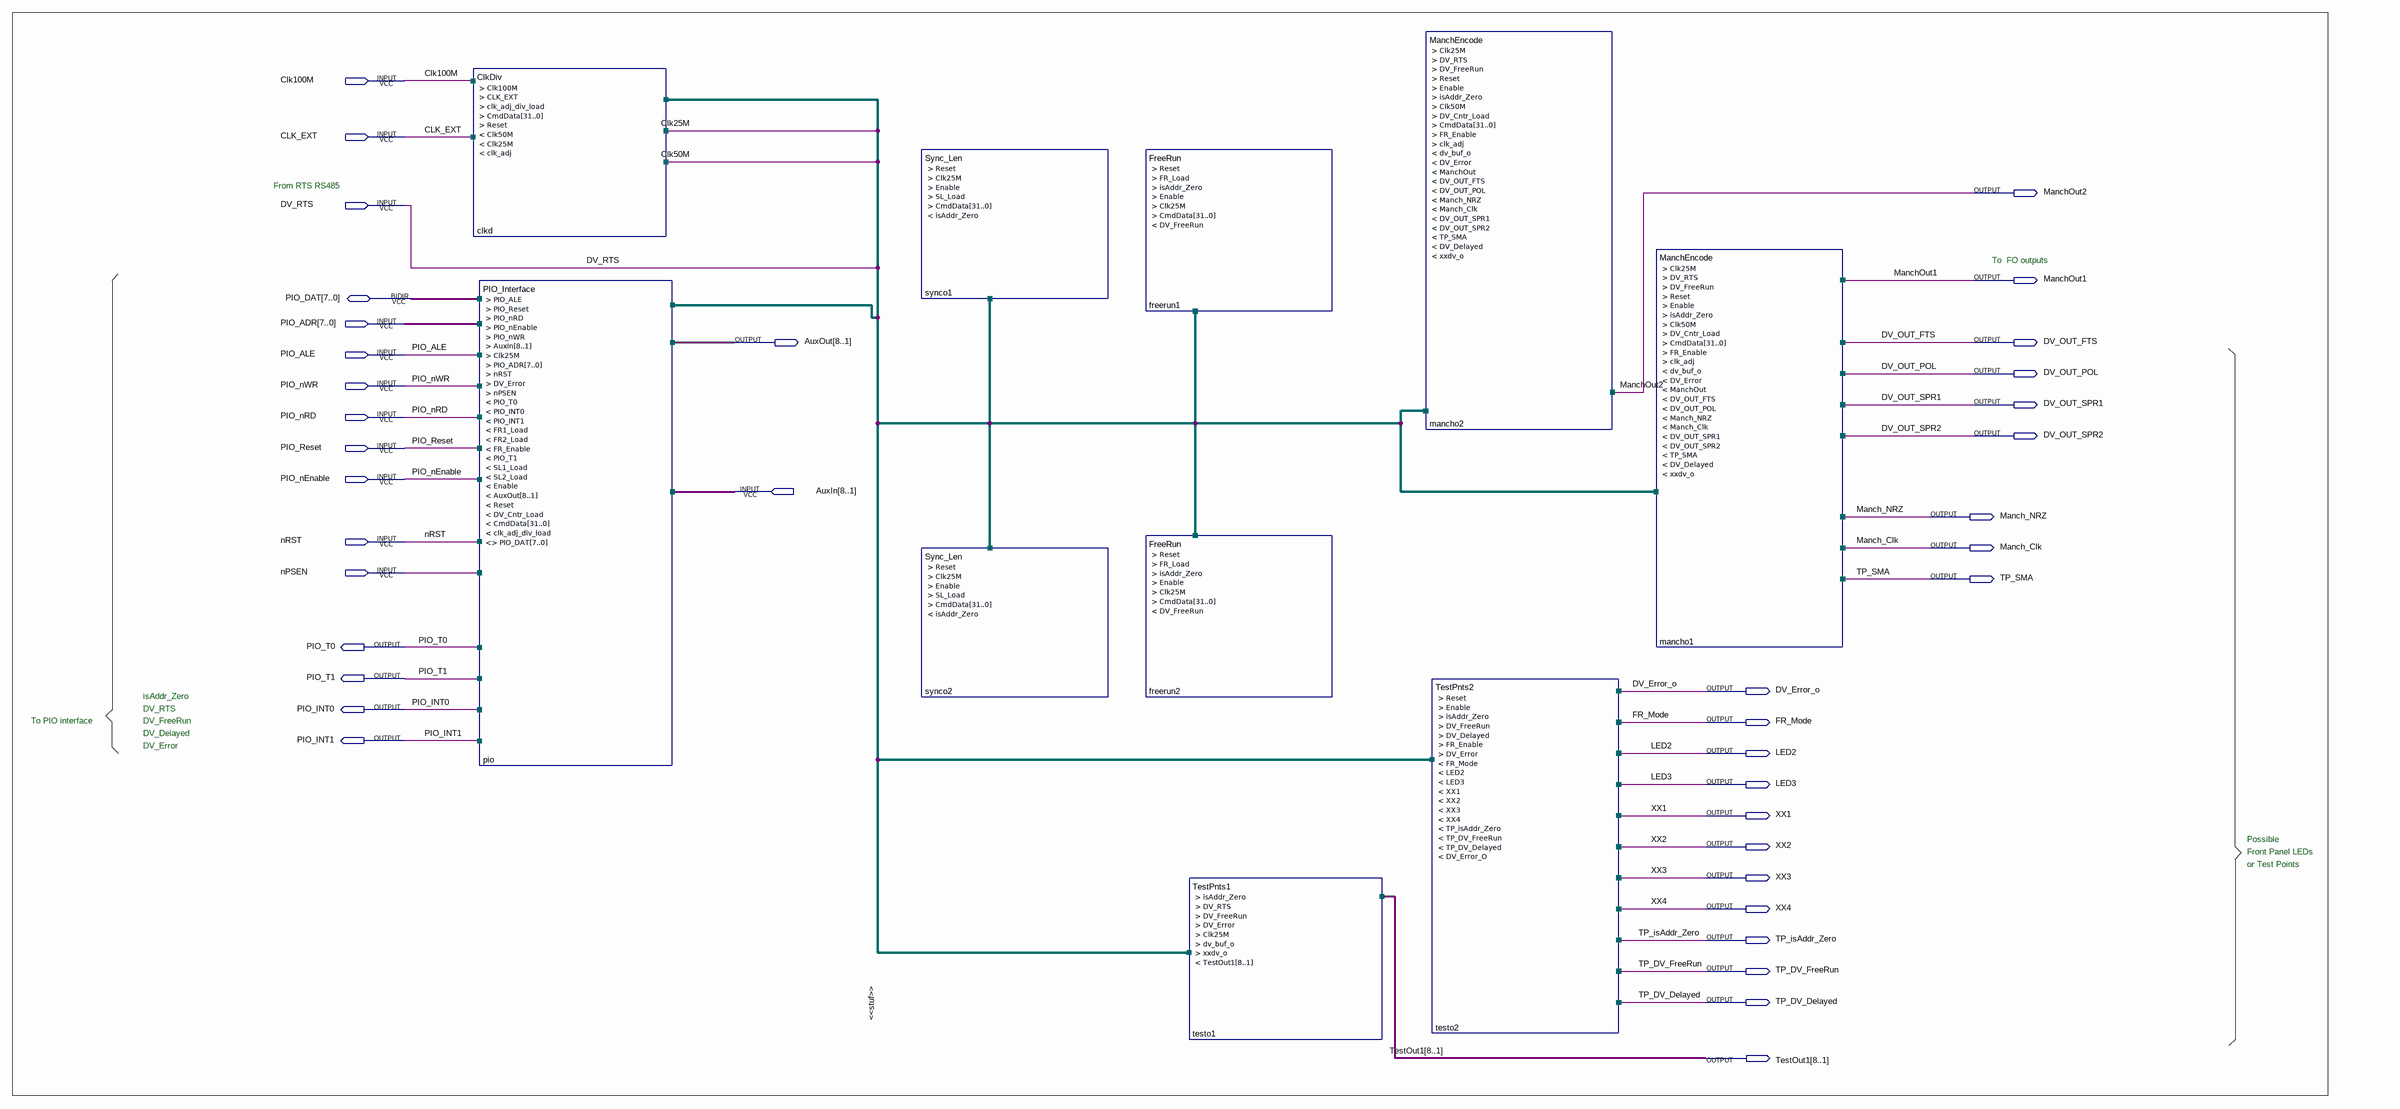
[diagram p0: schematic sheet]
// Quartus schematic SyncBox.bdf as structural Verilog: 10 symbols, 39 pins
module SyncBox (
  input  Clk100M,
  input  CLK_EXT,
  input  DV_RTS,
  input  [7:0] PIO_ADR,
  input  PIO_ALE,
  input  PIO_nWR,
  input  PIO_nRD,
  input  PIO_Reset,
  input  PIO_nEnable,
  input  [8:1] AuxIn,
  input  nRST,
  input  nPSEN,
  inout  [7:0] PIO_DAT,
  output ManchOut2,
  output ManchOut1,
  output [8:1] AuxOut,
  output DV_OUT_FTS,
  output DV_OUT_POL,
  output DV_OUT_SPR1,
  output DV_OUT_SPR2,
  output Manch_NRZ,
  output Manch_Clk,
  output TP_SMA,
  output PIO_T0,
  output PIO_T1,
  output DV_Error_o,
  output PIO_INT0,
  output FR_Mode,
  output PIO_INT1,
  output LED2,
  output LED3,
  output XX1,
  output XX2,
  output XX3,
  output XX4,
  output TP_isAddr_Zero,
  output TP_DV_FreeRun,
  output TP_DV_Delayed,
  output [8:1] TestOut1
);

  wire Clk25M, Clk50M, clk_adj, clk_adj_div_load, dv_buf_oX, DV_DelayedX, DV_ErrorX, DV_FreeRun1,
       DV_FreeRun2, FR1_Load, FR2_Load, isAddr_Zero1, isAddr_Zero2, Reset, SL1_Load, SL2_Load, xxdv_oX;
  wire [31:0] CmdData;

  ClkDiv clkd (
    .Clk100M(Clk100M), .CLK_EXT(CLK_EXT), .clk_adj_div_load(clk_adj_div_load), .CmdData(CmdData),
    .Reset(Reset), .Clk50M(Clk50M), .Clk25M(Clk25M), .clk_adj(clk_adj));
  PIO_Interface pio (
    .PIO_ALE(PIO_ALE), .PIO_Reset(PIO_Reset), .PIO_nRD(PIO_nRD), .PIO_nEnable(PIO_nEnable),
    .PIO_nWR(PIO_nWR), .AuxIn(AuxIn), .PIO_ADR(PIO_ADR), .nRST(nRST), .nPSEN(nPSEN), .PIO_T0(PIO_T0),
    .PIO_INT0(PIO_INT0), .PIO_INT1(PIO_INT1), .FR1_Load(FR1_Load), .FR2_Load(FR2_Load), .PIO_T1(PIO_T1),
    .SL1_Load(SL1_Load), .SL2_Load(SL2_Load), .AuxOut(AuxOut), .PIO_DAT(PIO_DAT));  // open: Clk25M, DV_Error, FR_Enable, Enable, Reset, DV_Cntr_Load, CmdData, clk_adj_div_load
  Sync_Len synco1 (.SL_Load(SL1_Load), .isAddr_Zero(isAddr_Zero1));  // open: Reset, Clk25M, Enable, CmdData
  Sync_Len synco2 (.SL_Load(SL2_Load), .isAddr_Zero(isAddr_Zero2));  // open: Reset, Clk25M, Enable, CmdData
  FreeRun freerun1 (
    .FR_Load(FR1_Load), .isAddr_Zero(isAddr_Zero1), .DV_FreeRun(DV_FreeRun1));  // open: Reset, Enable, Clk25M, CmdData
  FreeRun freerun2 (
    .FR_Load(FR2_Load), .isAddr_Zero(isAddr_Zero2), .DV_FreeRun(DV_FreeRun2));  // open: Reset, Enable, Clk25M, CmdData
  TestPnts1 testo1 (
    .isAddr_Zero(isAddr_Zero1), .DV_Error(DV_ErrorX), .dv_buf_o(dv_buf_oX), .xxdv_o(xxdv_oX),
    .TestOut1(TestOut1));  // open: DV_RTS, DV_FreeRun, Clk25M
  ManchEncode mancho2 (
    .DV_FreeRun(DV_FreeRun2), .isAddr_Zero(isAddr_Zero2), .ManchOut(ManchOut2));  // open: Clk25M, DV_RTS, Reset, Enable, Clk50M, DV_Cntr_Load, CmdData, FR_Enable, clk_adj, dv_buf_o, DV_Error, DV_OUT_FTS, DV_OUT_POL, Manch_NRZ, Manch_Clk, DV_OUT_SPR1, DV_OUT_SPR2, TP_SMA, DV_Delayed, xxdv_o
  TestPnts2 testo2 (
    .isAddr_Zero(isAddr_Zero1), .DV_Delayed(DV_DelayedX), .DV_Error(DV_ErrorX), .FR_Mode(FR_Mode),
    .LED2(LED2), .LED3(LED3), .XX1(XX1), .XX2(XX2), .XX3(XX3), .XX4(XX4), .TP_isAddr_Zero(TP_isAddr_Zero),
    .TP_DV_FreeRun(TP_DV_FreeRun), .TP_DV_Delayed(TP_DV_Delayed), .DV_Error_O(DV_Error_o));  // open: Reset, Enable, DV_FreeRun, FR_Enable
  ManchEncode mancho1 (
    .DV_FreeRun(DV_FreeRun1), .isAddr_Zero(isAddr_Zero1), .dv_buf_o(dv_buf_oX), .DV_Error(DV_ErrorX),
    .ManchOut(ManchOut1), .DV_OUT_FTS(DV_OUT_FTS), .DV_OUT_POL(DV_OUT_POL), .Manch_NRZ(Manch_NRZ),
    .Manch_Clk(Manch_Clk), .DV_OUT_SPR1(DV_OUT_SPR1), .DV_OUT_SPR2(DV_OUT_SPR2), .TP_SMA(TP_SMA),
    .DV_Delayed(DV_DelayedX), .xxdv_o(xxdv_oX));  // open: Clk25M, DV_RTS, Reset, Enable, Clk50M, DV_Cntr_Load, CmdData, FR_Enable, clk_adj

  // Notes on the sheet:
  //   From RTS RS485
  //   To  FO outputs
  //   isAddr_Zero
  //   DV_RTS
  //   To PIO interface
  //   DV_FreeRun
  //   DV_Delayed
  //   DV_Error
  //   Possible
  //   Front Panel LEDs 
  //   or Test Points
endmodule
